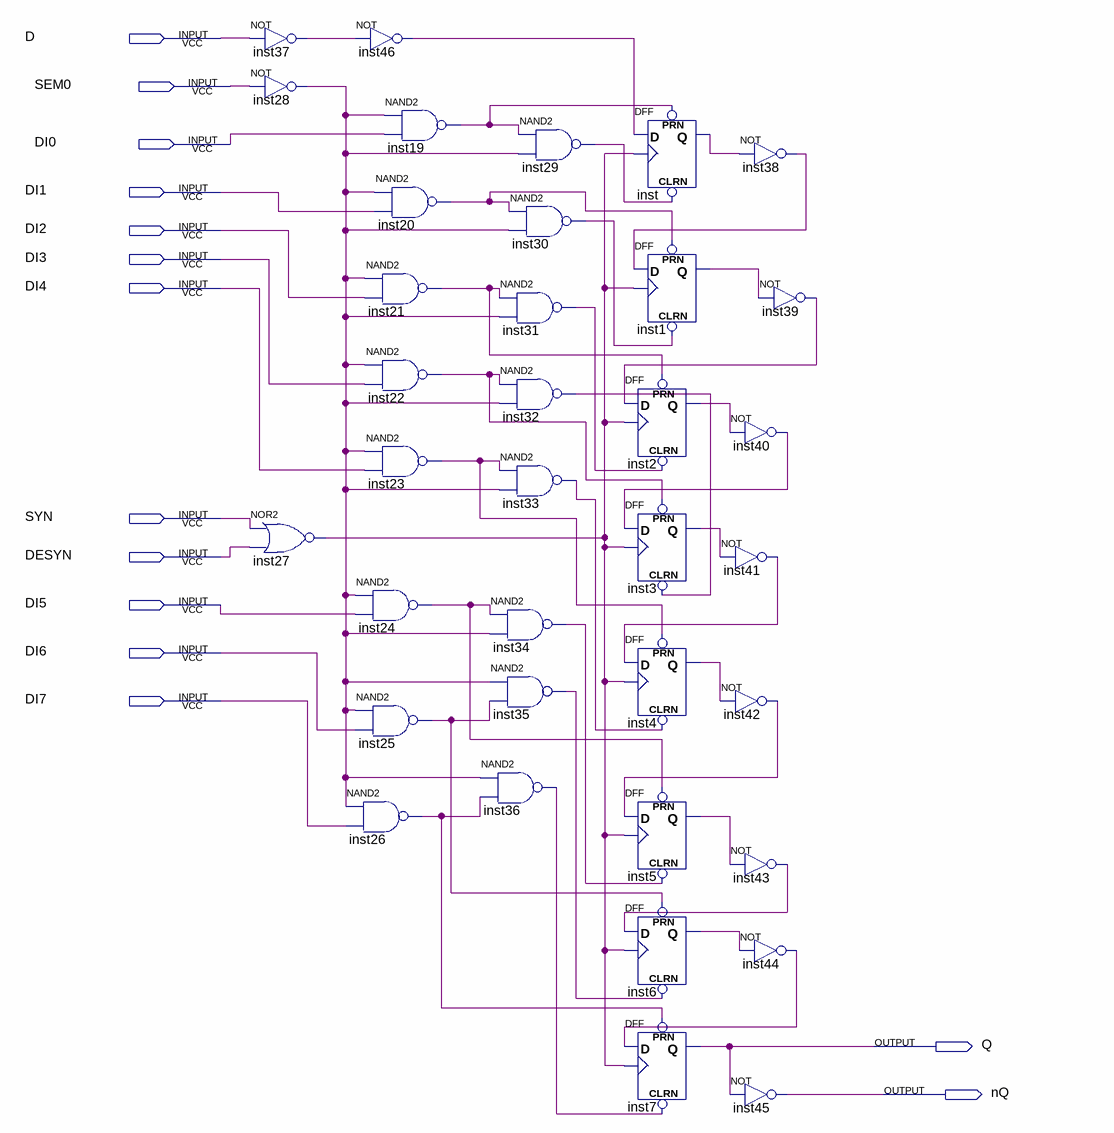
[diagram p0: schematic sheet]
// Quartus schematic KP1533IR9.bdf as structural Verilog: 36 symbols, 14 pins
module KP1533IR9 (
  input  D,
  input  SEM0,
  input  DI0,
  input  DI1,
  input  DI2,
  input  DI3,
  input  DI4,
  input  SYN,
  input  DESYN,
  input  DI5,
  input  DI6,
  input  DI7,
  output Q,
  output nQ
);

  wire inst1_q, inst2_q, inst3_q, inst4_q, inst5_q, inst6_q, inst19_out, inst20_out, inst21_out, inst22_out,
       inst23_out, inst24_out, inst25_out, inst26_out, inst27_out, inst28_out, inst29_out, inst30_out,
       inst31_out, inst32_out, inst33_out, inst34_out, inst35_out, inst36_out, inst37_out, inst38_out,
       inst39_out, inst40_out, inst41_out, inst42_out, inst43_out, inst44_out, inst46_out, inst_q;

  not inst37 (inst37_out, D);
  not inst28 (inst28_out, SEM0);
  nor inst27 (inst27_out, SYN, DESYN);
  not inst46 (inst46_out, inst37_out);
  nand inst19 (inst19_out, inst28_out, DI0);
  nand inst20 (inst20_out, inst28_out, DI1);
  nand inst21 (inst21_out, inst28_out, DI2);
  nand inst22 (inst22_out, inst28_out, DI3);
  nand inst23 (inst23_out, inst28_out, DI4);
  nand inst24 (inst24_out, inst28_out, DI5);
  nand inst25 (inst25_out, inst28_out, DI6);
  nand inst26 (inst26_out, inst28_out, DI7);
  nand inst36 (inst36_out, inst28_out, inst26_out);
  nand inst29 (inst29_out, inst19_out, inst28_out);
  nand inst30 (inst30_out, inst20_out, inst28_out);
  nand inst31 (inst31_out, inst21_out, inst28_out);
  nand inst32 (inst32_out, inst22_out, inst28_out);
  nand inst33 (inst33_out, inst23_out, inst28_out);
  nand inst34 (inst34_out, inst24_out, inst28_out);
  nand inst35 (inst35_out, inst28_out, inst25_out);
  DFF inst (.CLRN(inst29_out), .CLK(inst27_out), .D(inst46_out), .PRN(inst19_out), .Q(inst_q));
  DFF inst1 (.CLRN(inst30_out), .CLK(inst27_out), .D(inst38_out), .PRN(inst20_out), .Q(inst1_q));
  DFF inst2 (.CLRN(inst31_out), .CLK(inst27_out), .D(inst39_out), .PRN(inst21_out), .Q(inst2_q));
  DFF inst3 (.CLRN(inst32_out), .CLK(inst27_out), .D(inst40_out), .PRN(inst22_out), .Q(inst3_q));
  DFF inst4 (.CLRN(inst33_out), .CLK(inst27_out), .D(inst41_out), .PRN(inst23_out), .Q(inst4_q));
  DFF inst5 (.CLRN(inst34_out), .CLK(inst27_out), .D(inst42_out), .PRN(inst24_out), .Q(inst5_q));
  DFF inst6 (.CLRN(inst35_out), .CLK(inst27_out), .D(inst43_out), .PRN(inst25_out), .Q(inst6_q));
  DFF inst7 (.CLRN(inst36_out), .CLK(inst27_out), .D(inst44_out), .PRN(inst26_out), .Q(Q));
  not inst38 (inst38_out, inst_q);
  not inst39 (inst39_out, inst1_q);
  not inst40 (inst40_out, inst2_q);
  not inst41 (inst41_out, inst3_q);
  not inst42 (inst42_out, inst4_q);
  not inst43 (inst43_out, inst5_q);
  not inst44 (inst44_out, inst6_q);
  not inst45 (nQ, Q);
endmodule
